# Altium project MCU Circuit.PrjPcb
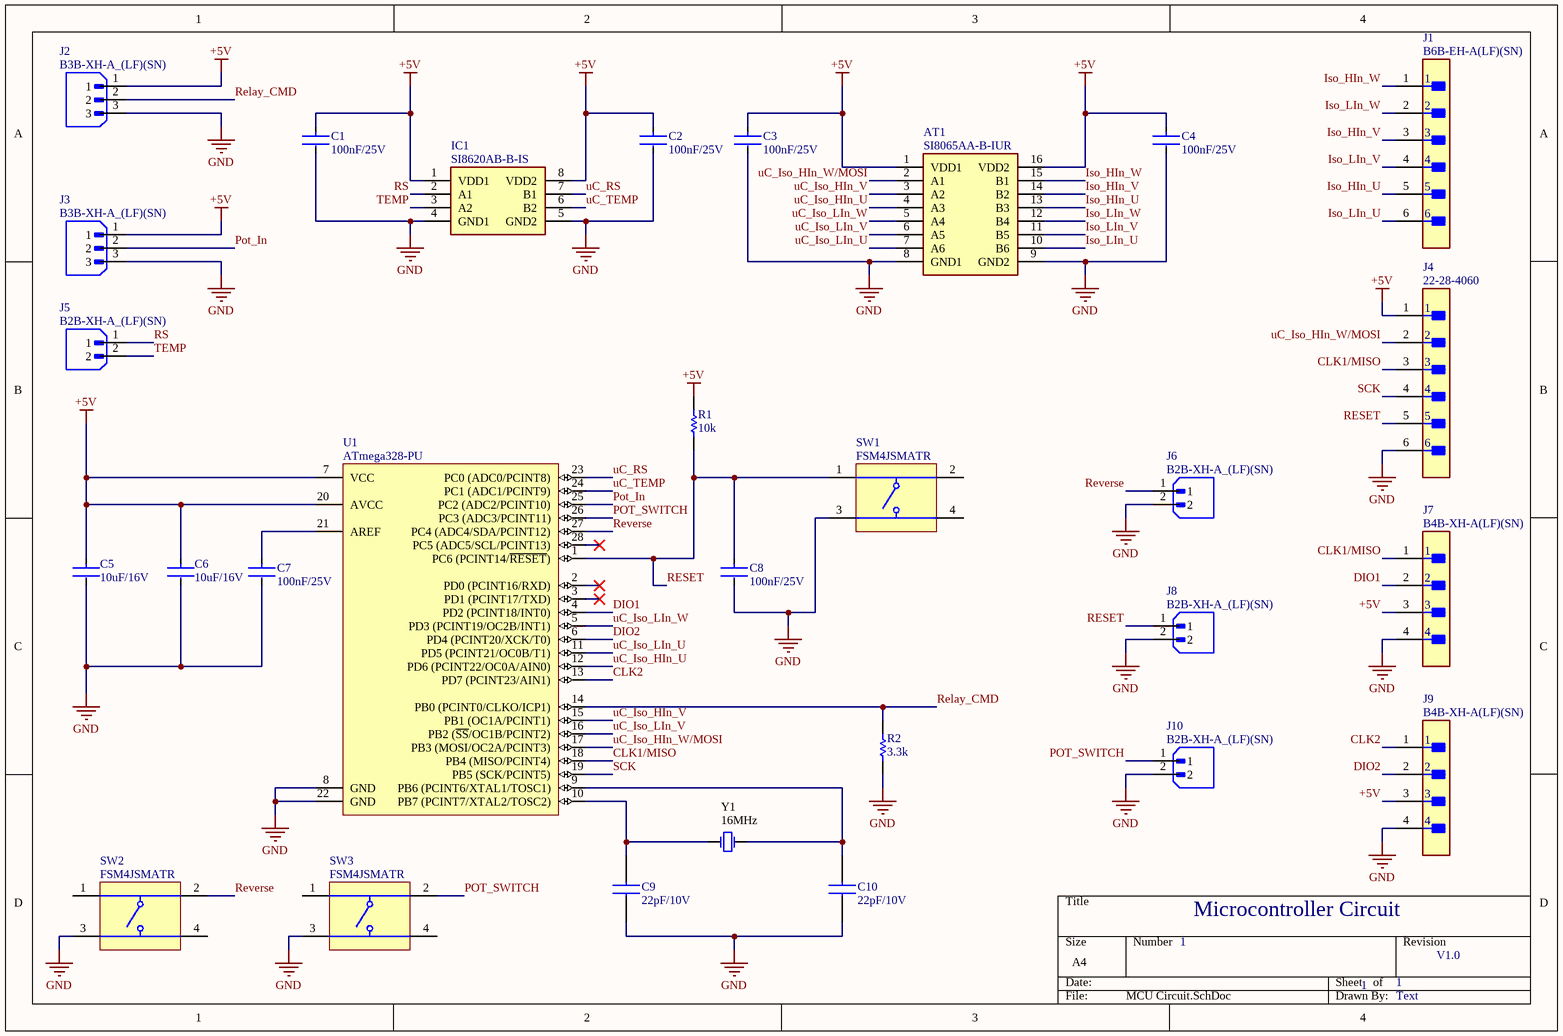
[diagram p0: MCU Circuit.SchDoc]
1 sheet, 29 parts. Net scope: global (net labels, ports and power ports of the same name join across sheets).
Board file: MCU Circuit.PcbDoc

## Sheet MCU Circuit.SchDoc
size A4; SheetNumber: 1; SheetTotal: 1

### Parts
AT1  SI8065AA-B-IUR  [SOP64P600X175-16N]
C1  100nF/25V  [FP-1210-L_3_3_0_4-W_2_5_0-MFG]
C2  100nF/25V  [FP-1210-L_3_3_0_4-W_2_5_0-MFG]
C3  100nF/25V  [FP-1210-L_3_3_0_4-W_2_5_0-MFG]
C4  100nF/25V  [FP-1210-L_3_3_0_4-W_2_5_0-MFG]
C5  10uF/16V  [FP-1206-L_3_2_0_2-W_1_6_0-IPC_A]
C6  10uF/16V  [FP-1206-L_3_2_0_2-W_1_6_0-IPC_A]
C7  100nF/25V  [FP-1210-L_3_3_0_4-W_2_5_0-MFG]
C8  100nF/25V  [FP-1210-L_3_3_0_4-W_2_5_0-MFG]
C9  22pF/10V  [CAPC3216X90N]
C10  22pF/10V  [CAPC3216X90N]
IC1  SI8620AB-B-IS  [SOIC127P600X175-8N]
J1  B6B-EH-A(LF)(SN)  [FP-B6B-EH-A_LF_SN-MFG]
J2  B3B-XH-A_(LF)(SN)  [JST_B3B-XH-A (LF)(SN)]
J3  B3B-XH-A_(LF)(SN)  [JST_B3B-XH-A (LF)(SN)]
J4  22-28-4060  [FP-22-28-4060-MFG]
J5  B2B-XH-A_(LF)(SN)  [JST_B2B-XH-A_(LF)(SN)]
J6  B2B-XH-A_(LF)(SN)  [JST_B2B-XH-A_(LF)(SN)]
J7  B4B-XH-A(LF)(SN)  [FP-B4B-XH-A_LF_SN-MFG]
J8  B2B-XH-A_(LF)(SN)  [JST_B2B-XH-A_(LF)(SN)]
J9  B4B-XH-A(LF)(SN)  [FP-B4B-XH-A_LF_SN-MFG]
J10  B2B-XH-A_(LF)(SN)  [JST_B2B-XH-A_(LF)(SN)]
R1  10k  [RESC3225X70X50NL20T20]
R2  3.3k  [RESC3225X70X50NL20T20]
SW1  FSM4JSMATR  [TECO-FSM4JSMATR_V]
SW2  FSM4JSMATR  [TECO-FSM4JSMATR_V]
SW3  FSM4JSMATR  [TECO-FSM4JSMATR_V]
U1  ATmega328-PU  [28P3]
Y1  16MHz  [FOX-FOXSLF160-20]

### Nets
+5V: AT1.1(VDD1) AT1.16(VDD2) C1.1 C2.1 C3.1 C4.1 C5.1 C6.1 IC1.1(VDD1) IC1.8(VDD2) J2.1 J3.1 J4.1 J7.3 J9.3 R1.2 U1.7(VCC) U1.20(AVCC)
GND: AT1.8(GND1) AT1.9(GND2) C1.2 C2.2 C3.2 C4.2 C5.2 C6.2 C7.2 C8.2 C9.1 C10.1 IC1.4(GND1) IC1.5(GND2) J2.3 J3.3 J4.6 J6.2 J7.4 J8.2 J9.4 J10.2 R2.1 SW1.3 SW2.3 SW3.3 U1.8(GND) U1.22(GND)
CLK1/MISO: J4.3 J7.1 U1.18(PB4_(MISO/PCINT4))
CLK2: J9.1 U1.13(PD7_(PCINT23/AIN1))
DIO1: J7.2 U1.4(PD2_(PCINT18/INT0))
DIO2: J9.2 U1.6(PD4_(PCINT20/XCK/T0))
Iso_HIn_U: AT1.13(B3) J1.5
Iso_HIn_V: AT1.14(B2) J1.3
Iso_HIn_W: AT1.15(B1) J1.1
Iso_LIn_U: AT1.10(B6) J1.6
Iso_LIn_V: AT1.11(B5) J1.4
Iso_LIn_W: AT1.12(B4) J1.2
Pot_In: J3.2 U1.25(PC2_(ADC2/PCINT10))
POT_SWITCH: J10.1 SW3.2 U1.26(PC3_(ADC3/PCINT11))
Relay_CMD: J2.2 R2.2 U1.14(PB0_(PCINT0/CLKO/ICP1))
RESET: C8.1 J4.5 J8.1 R1.1 SW1.1 U1.1(PC6_(PCINT14/~{RESET}))
Reverse: J6.1 SW2.2 U1.27(PC4_(ADC4/SDA/PCINT12))
RS: IC1.2(A1) J5.1
SCK: J4.4 U1.19(PB5_(SCK/PCINT5))
TEMP: IC1.3(A2) J5.2
uC_Iso_HIn_U: AT1.4(A3) U1.12(PD6_(PCINT22/OC0A/AIN0))
uC_Iso_HIn_V: AT1.3(A2) U1.15(PB1_(OC1A/PCINT1))
uC_Iso_HIn_W/MOSI: AT1.2(A1) J4.2 U1.17(PB3_(MOSI/OC2A/PCINT3))
uC_Iso_LIn_U: AT1.7(A6) U1.11(PD5_(PCINT21/OC0B/T1))
uC_Iso_LIn_V: AT1.6(A5) U1.16(PB2_(~{SS}/OC1B/PCINT2))
uC_Iso_LIn_W: AT1.5(A4) U1.5(PD3_(PCINT19/OC2B/INT1))
uC_RS: IC1.7(B1) U1.23(PC0_(ADC0/PCINT8))
uC_TEMP: IC1.6(B2) U1.24(PC1_(ADC1/PCINT9))
NetC7_1: C7.1 U1.21(AREF)
NetC9_2: C9.2 U1.10(PB7_(PCINT7/XTAL2/TOSC2)) Y1.1
NetC10_2: C10.2 U1.9(PB6_(PCINT6/XTAL1/TOSC1)) Y1.2

Not connected (* = marked no-connect by the designer): SW1 2 4; SW2 1 4; SW3 1 4; U1 2(PD0_(PCINT16/RXD))* 3(PD1_(PCINT17/TXD))* 28(PC5_(ADC5/SCL/PCINT13))*

### Notes on the sheet
- Microcontroller Circuit
- 1
- V1.0
- Text

### Library data of the parts
AT1 = SI8065AA-B-IUR: Attenuator or Isolator; Manufacturer_Name: Silicon Labs; Datasheet Link: https://www.mouser.com/datasheet/2/368/Si80xx-1kV-1398000.pdf; Height: 1.75mm; Manufacturer_Part_Number: SI8065AA-B-IUR; Mouser Part Number: 634-SI8065AA-B-IUR; Mouser Price/Stock: https://www.mouser.com/Search/Refine.aspx?Keyword=634-SI8065AA-B-IUR; Arrow Part Number: SI8065AA-B-IUR; Arrow Price/Stock: https://www.arrow.com/en/products/si8065aa-b-iur/silicon-labs
C1-C4 C7 C8 = CMP-1038-01657-2: General Purpose Ceramic Capacitor, 1210, 100nF, 10%, X7R, +15%, 50V; Insulation Resistance: 100GR; Dissipation Factor: 2.5%; Number of Pins: 2; Max Operating Temperature: 125°C; Tolerance: 10%; Length: 3.2mm; Width: 0.098inch; Dielectric: X7R; Thickness: 0.037inch; Height: 0.94mm; Capacitance: 100nF; Voltage Rating: 50V; Voltage: 50V; Construction: Flat; Termination: SMD/SMT; Depth: 2.5mm; Mount: Surface Mount; Series: -; Min Operating Temperature: -55°C; Case Code (Imperial): 1210; Packaging: Tape and Reel; RoHS Compliant: Yes; Voltage Rating (DC): 50V; Case/Package: 1210; Package Quantity: 1; REACH SVHC: No SVHC; Case Code (Metric): 3225; Lead Free: Lead Free
C5 C6 = CMP-04427-021870-1: General Purpose Ceramic Capacitor, 1206, 10uF, 10%, X5R, 15%, 10V; Tolerance: 10%; Thickness: 0.07inch; Voltage: 10V; Termination: SMD/SMT; REACH SVHC: No SVHC; Radiation Hardening: No; Capacitance: 10uF; Lead Free: Lead Free; Min Operating Temperature: -55°C; Contact Plating: Tin; Length: 3.2mm; Dielectric: X5R; Packaging: Tape and Reel; Construction: Flat; RoHS Compliant: Yes; Series: -; Voltage Rating: 10V; Height: 0.07mm; Width: 0.063inch; Voltage Rating (DC): 10V; Mount: Surface Mount; Depth: 1.6mm; Number of Pins: 2; Case Code (Imperial): 1206; Size: 1.78mm; Case/Package: 1206; Max Operating Temperature: 85°C; Package Quantity: 1; Case Code (Metric): 3216
C9 C10 = 885012008002: Capacitor; Manufacturer_Name: Wurth Elektronik; Datasheet Link: https://katalog.we-online.com/pbs/datasheet/885012008002.pdf; Height: 0.9mm; Manufacturer_Part_Number: 885012008002; Mouser Part Number: 710-885012008002; Mouser Price/Stock: https://www.mouser.com/Search/Refine.aspx?Keyword=710-885012008002
IC1 = SI8620AB-B-IS: Integrated Circuit; Manufacturer_Name: Skyworks; Datasheet Link: https://www.skyworksinc.com/-/media/Skyworks/SL/documents/public/data-sheets/si86xx-1Mbps-datasheet.pdf; Height: 1.75mm; Manufacturer_Part_Number: SI8620AB-B-IS; Mouser Part Number: 634-SI8620AB-B-IS; Mouser Price/Stock: https://www.mouser.co.uk/ProductDetail/Skyworks-Solutions-Inc/SI8620AB-B-IS?qs=j6MGy4L9yX39miC9%252BsIUmA%3D%3D; Arrow Part Number: SI8620AB-B-IS; Arrow Price/Stock: https://www.arrow.com/en/products/si8620ab-b-is/skyworks-solutions?region=nac
J1 = CMP-17439-000293-1: CONN HEADER VERT 6POS 2.5MM; Voltage Rating: 250V; Number of Positions: 6; Current Rating: 3A; Mated Stacking Heights: 8.1mm; Gender: Male; Insulation Material: Nylon; Number of Contacts: 6; Contact Plating: Tin; Pitch: 2.5mm; Orientation: Straight; Insulation Color: Natural; Packaging: Bulk; Termination: Solder; Flammability Rating: UL94 V-0; Lead Free: Lead Free; Contact Mating Length: 0.13inch; Color: Natural; Contact Finish - Mating: TIN; Connector Type: Header; Contact Shape: Square; Contact Type: Male Pin; Series: EH; Contact Material: Brass; Fastening Type: Friction; Number of Rows: 1; Mount: Through Hole; Housing Color: White
J2 J3 = B3B-XH-A_(LF)(SN): Connector Header Through Hole 3 position 0.098 (2.50mm); MF: JST Sales America Inc.; MP: B3B-XH-A (LF)(SN); SnapEDA_Link: https://www.snapeda.com/parts/B3B-XH-A%20(LF)(SN)/JST+Sales+America+Inc./view-part/?ref=snap; Package: None; Value: *; Check_prices: https://www.snapeda.com/parts/B3B-XH-A%20(LF)(SN)/JST+Sales+America+Inc./view-part/?ref=eda
J4 = CMP-04776-000763-1: CONN HEADER VERT 6POS 2.54MM; Voltage Rating: 250V; Current Rating: 4A; Number of Contacts: 6; Max Voltage Rating (DC): 250.25kV; Gender: Male; Contact Resistance: 20mR; Connector Type: Male Pin; Color: Black; Max Voltage Rating (AC): 250V; Pitch: 2.54mm; Orientation: Straight; Max Operating Temperature: 75°C; Contact Plating: Tin; Depth: 2.49mm; Contact Type: Male Pin; Number of Positions: 6; Length: 15.24mm; Packaging: Bulk; Mount: Through Hole; Housing Material: Thermoplastic; Housing Color: Black; Termination: Solder; Contact Material: Brass; Min Operating Temperature: 0°C; Series: KK® 42375; Number of Rows: 1; Package Quantity: 1; RoHS Compliant: Yes; Contact Mating Length: 0.24inch
J5 J6 J8 J10 = B2B-XH-A_(LF)(SN): Connector Header Through Hole 2 position 0.098 (2.50mm); MF: JST Sales; MP: B2B-XH-A (LF)(SN); SnapEDA_Link: https://www.snapeda.com/parts/B2B-XH-A%20(LF)(SN)/JST+Sales+America+Inc./view-part/?ref=snap; Package: None; Value: *; Check_prices: https://www.snapeda.com/parts/B2B-XH-A%20(LF)(SN)/JST+Sales+America+Inc./view-part/?ref=eda
J7 J9 = CMP-17439-000250-1: CONN HEADER VERT 4POS 2.5MM; Number of Contacts: 4; Contact Resistance: 20mR; Voltage Rating: 250V; Max Current Rating: 3A; Gender: Male; Wire/Cable Gauge: 22AWG; Mated Stacking Heights: 9.8mm; Insulation Resistance: 1GR; Orientation: Straight; Contact Type: Male Pin; Contact Finish - Mating: TIN; Series: XH; Max Voltage Rating (AC): 250V; Lead Pitch: 2.5mm; Contact Shape: Square; Insulation Color: Natural; Termination: Solder; Lead Free: Lead Free; Voltage Rating (AC): 250V; Number of Rows: 1; Flammability Rating: UL94 V-0; Number of Positions: 4; Max Operating Temperature: 85°C; Package Quantity: 500; Mount: Through Hole; REACH SVHC: No SVHC; Connector Type: Header; Insulation Material: Nylon; Fastening Type: Detent; Min Operating Temperature: -25°C; Housing Color: White; Packaging: Bulk; Contact Plating: Tin; Contact Material: Brass; Max Voltage Rating (DC): 250V; Housing Material: Polyamide; Color: Natural; Material: Polyamide; Pitch: 2.5mm; Depth: 5.75mm; Current Rating: 3A; Length: 12.4mm
R1 = CMP-2005-03838-2: 1210; Part Number: ERJ-L14KF10CU; Manufacturer: Panasonic
R2 = CMP-2005-03838-2: 3.3k 0.5W 1210 SMD Resistor; Part Number: ERJ-L14KF10CU; Manufacturer: Panasonic
SW1-SW3 = CMP-2000-07486-1: Micro Miniature Push Button Switch FSM JSM, 50 mA, -35 to 85 degC, 4-Pin SMD, RoHS, Tape and Reel; Manufacturer: TE Connectivity; Mechanical Life: 100000Cycles; Current Rating: 50mA; Actuator Material: Polyamide; Max Voltage Rating (DC): 12V; Capacitance: 0f; Illumination Type: Illuminated; Voltage Rating (DC): 24V; Case\/Package: SMD/SMT; Operating Force: 160gf; Contact Resistance: 100mOhm; Actuator Length: 0.055inch; Switch Travel: 0.25mm; Throw Configuration: SPST; Termination: GullWing; Contact Plating: Silver; Orientation: Straight; Mounting Technology: SurfaceMount; REACH SVHC: Unknown; Electrical Life: 100000Cycles; Package Reference: FSM4JSMATR; Max Operating Temperature: 85degC; Manufacturer URL: http://www.te.com/; Package Description: 4-Pin Surface Mount Device, Body 6 x 6 mm, Pitch 4.5 mm; Datasheet Version: Rev. V, 02/2015; Packaging: TapeandReel; Min Operating Temperature: -35degC; Mount: SurfaceMount; Contact Current Rating: 50mA; Contact Material: CopperAlloy; Package Quantity: 1200; Datasheet URL: http://www.te.com/commerce/DocumentDelivery/DDEController?Action=showdoc&DocId=Customer+Drawing%7F2-1437565-7%7FV%7Fpdf%7FEnglish%7FENG_CD_2-1437565-7_V.pdf%7F4-1437565-2; RoHSCompliant: true
U1 = CMP-0095-00015-2: 8-bit AVR Microcontroller, 32KB Flash, 1KB EEPROM, 2KB SRAM, 28-pin PDIP, Industrial Grade (-40°C to 85°C); ComponentLink3Description: ATmega48A/48PA/88A/88PA/168A/168PA/328/328P Summary; RevisionNote: DatasheetVersion updated. URLs added.; DatasheetVersion: revD, May-2011; ComponentLink1URL: http://www.atmel.com/; PackageVersion: revB, Sep-2001; PackageDescription: 28-lead (0.300"/7.62mm Wide) Plastic Dual Inline Package (PDIP); PackageReference: 28P3; ComponentLink1Description: Manufacturer URL; ComponentLink2Description: ATmega48A/48PA/88A/88PA/168A/168PA/328/328P Datasheet; ComponentLink3URL: http://www.atmel.com/dyn/resources/prod_documents/8271S.pdf; ComponentLink2URL: http://www.atmel.com/dyn/resources/prod_documents/8271.pdf
Y1 = CMP-1749-00003-1: Resistance Weld Thru-Hole Crystal, 16 MHz, -20 to 70 degC, 2-Pin THD, RoHS, Bulk; Voltage Rating: 250 V; Tolerance: 1%; Resistance: 221 kohm; Case\Package: Axial; Power Rating: 250 mW; RoHSCompliant: true; Package Quantity: 200; Packaging: Bulk; Min Operating Temperature: -55 degC; DatasheetVersion: Mar-15; ComponentLink1URL: http://www.foxonline.com/; Max Operating Temperature: 155 degC; PackageReference: FOXSLF160-20; Mount: Through Hole; PackageDescription: 2-Pin Through Hole Device, Body 11.35 x 4.65 mm; ComponentLink1Description: Manufacturer URL; ComponentLink2URL: http://www.foxonline.com/pdfs/hc49slf.pdf; ComponentLink2Description: Datasheet; Length: 0.248 inch